# Altium schematic sheet miscellaneous.SchDoc: FPGA-based Sudoku - miscellaneous
size A; Author: Justin Silver; DocumentNumber: 4; Revision: v1.0; SheetNumber: 4; SheetTotal: 4; ENG_APP_DATE: --/--/--; DSN_APP_DATE: --/--/--; CHK_APP_DATE: --/--/--
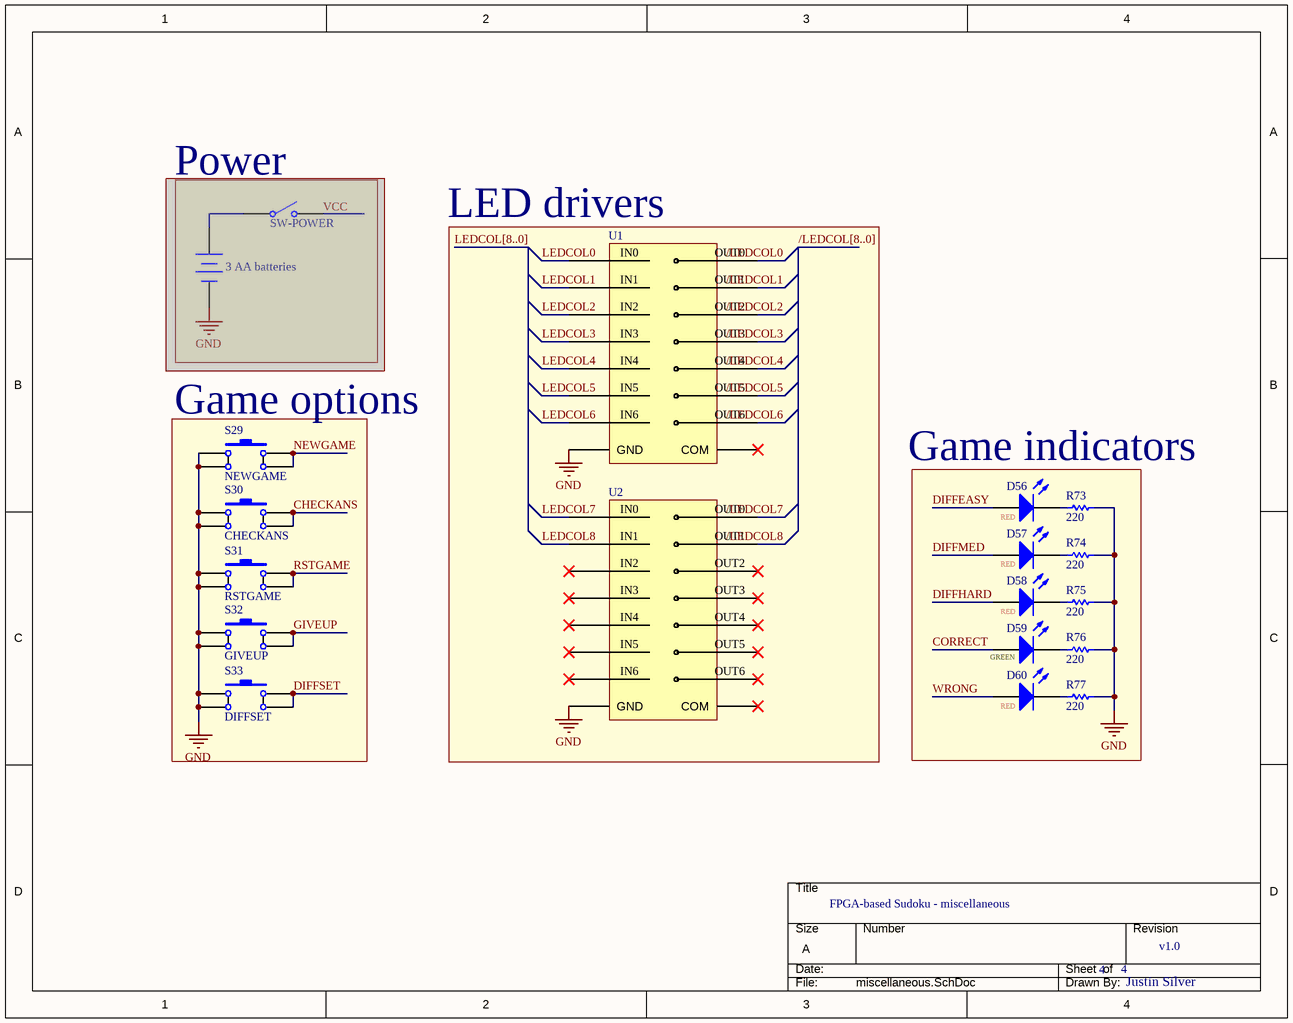
[diagram p0: miscellaneous.SchDoc]

## Parts
BT?  3 AA batteries  [BAT-2]  (masked out: inside a compile mask, not in the netlist)
D56  RED  [RED]
D57  RED  [RED]
D58  RED  [RED]
D59  GREEN  [green]
D60  RED  [RED]
R73  value 220  [SMD-0805-RES]  (hidden comment: Res1)
R74  value 220  [SMD-0805-RES]  (hidden comment: Res1)
R75  value 220  [SMD-0805-RES]  (hidden comment: Res1)
R76  value 220  [SMD-0805-RES]  (hidden comment: Res1)
R77  value 220  [SMD-0805-RES]  (hidden comment: Res1)
S29  NEWGAME  [SW_1825910-6-4]
S30  CHECKANS  [SW_1825910-6-4]
S31  RSTGAME  [SW_1825910-6-4]
S32  GIVEUP  [SW_1825910-6-4]
S33  DIFFSET  [SW_1825910-6-4]
S?  SW-POWER  [SPST-2]  (masked out: inside a compile mask, not in the netlist)
U1  (no value)  [DIL16]
U2  (no value)  [DIL16]

## Blocks framed on the sheet
Power: BT? S?
LED drivers: U1 U2
Game options: S29-S33

## Nets
GND: R73.2 R74.2 R75.2 R76.2 R77.2 S29.3 S29.4 S30.3 S30.4 S31.3 S31.4 S32.3 S32.4 S33.3 S33.4 U1.8(GND) U2.8(GND)
/LEDCOL0: U1.16(IN0)
/LEDCOL1: U1.15(IN1)
/LEDCOL2: U1.14(IN2)
/LEDCOL3: U1.13(IN3)
/LEDCOL4: U1.12(IN4)
/LEDCOL5: U1.11(IN5)
/LEDCOL6: U1.10(IN6)
/LEDCOL7: U2.16(IN0)
/LEDCOL8: U2.15(IN1)
CHECKANS: S30.1 S30.2
CORRECT: D59.1(A)
DIFFEASY: D56.1(A)
DIFFHARD: D58.1(A)
DIFFMED: D57.1(A)
DIFFSET: S33.1 S33.2
GIVEUP: S32.1 S32.2
LEDCOL0: U1.6(IN5)
LEDCOL1: U1.5(IN4)
LEDCOL2: U1.4(IN3)
LEDCOL3: U1.3(IN2)
LEDCOL4: U1.2(IN1)
LEDCOL5: U1.1(IN0)
LEDCOL6: U1.7(IN6)
LEDCOL7: U2.1(IN0)
LEDCOL8: U2.2(IN1)
NEWGAME: S29.1 S29.2
RSTGAME: S31.1 S31.2
WRONG: D60.1(A)
NetD56_2: D56.2(K) R73.1
NetD57_2: D57.2(K) R74.1
NetD58_2: D58.2(K) R75.1
NetD59_2: D59.2(K) R76.1
NetD60_2: D60.2(K) R77.1

Not connected (* = marked no-connect by the designer): U1 9(COM)*; U2 3(IN2)* 4(IN3)* 5(IN4)* 6(IN5)* 7(IN6)* 9(COM)* 10(IN6)* 11(IN5)* 12(IN4)* 13(IN3)* 14(IN2)*

## Buses and harness runs
bus /LEDCOL[8..0]
bus LEDCOL[8..0]

## Notes on the sheet
- Game indicators
- VCC and ground can be plugged directly in to devkit headers (power pin VCC 5P0 for example) from Dupont cables and from AA battery holder.
  Or, I could use a 4.5mm 1.3mm power jack, that way i have proper diode protection for reverse polarization
- DWG. NO.
- REV.
- SHT.
- THIS DOCUMENT AND THE DATA DISCLOSED HEREIN OR HEREWITH IS THE PROPERTY OF ALTIUM LIMITED AND MAY BE FREELY DISTRIBUTED IN WHOLE. NO RIGHTS ARE RESERVED OR EXPRESS OR IMPLIED WARANTEE GIVEN.
- REVISION
- DESCRIPTION
- DATE
- APPROVED
- ENG:
- APPROVALS
- PROJECT
- DSN:
- CHK:
- REFERENCE DOCUMENTS
- PROJECT REVISION:
- TITLE
- DOCUMENT REVISION:
- DESIGN ITEM:
- BOM:
- FAB DWG:
- PCB DWG:
- ASSY DWG:
- SCALE:
- SIZE
- B
- CAGE CODE
- FILE NAME
- DWG NO.
- SHEET
- OF
- REV
- (in symbol ULN2003A) OUT0; OUT1; OUT2; OUT3; OUT4; OUT5; OUT6

## Library data of the parts
BT? = Battery: Multicell Battery; Published: 24-Mar-1999; LatestRevisionDate: 17-Jul-2002; LatestRevisionNote: Re-released for DXP Platform.; PackageReference: BAT-2; Publisher: Altium Limited; PackageDescription: Battery; 2 Leads
D56-D60 = LED1: Typical RED GaAs LED; Published: 8-Jun-2000; LatestRevisionDate: 08-Jul-2005; LatestRevisionNote: Mech Layer 1 removed.; PackageReference: LED-1; Publisher: Altium Limited; PackageDescription: LED; 2 Leads
R73-R77 = Res1: Resistor; Published: 8-Jun-2000; LatestRevisionDate: 17-Jul-2002; LatestRevisionNote: Re-released for DXP Platform.; PackageReference: AXIAL-0.3; Publisher: Altium Limited; PackageDescription: Axial Device, Thru-Hole; 2 Leads; 0.3 in Pin Spacing
S29-S33 = SW-PB: Switch; Published: 24-Mar-1999; LatestRevisionDate: 17-Jul-2002; LatestRevisionNote: Re-released for DXP Platform.; PackageReference: SPST-2; Publisher: Altium Limited; PackageDescription: Switch; 2 Leads
S? = SW-SPST: Single-Pole, Single-Throw Switch; Published: 24-Mar-1999; LatestRevisionDate: 17-Jul-2002; LatestRevisionNote: Re-released for DXP Platform.; PackageReference: SPST-2; Publisher: Altium Limited; PackageDescription: Switch; 2 Leads
U1 U2 = ULN2003A